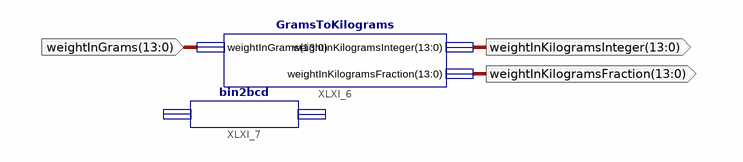
[diagram p0: schematic sheet 1]
// Xilinx ISE schematic esquematicoAAAAAAAAAAAAAAA.sch (artix7) as structural Verilog: 2 symbols, 3 ports
module esquematicoAAAAAAAAAAAAAAA (
  input  [13:0] weightInGrams,
  output [13:0] weightInKilogramsInteger,
  output [13:0] weightInKilogramsFraction
);

  GramsToKilograms XLXI_6 (
    .weightInGrams(weightInGrams), .weightInKilogramsInteger(weightInKilogramsInteger),
    .weightInKilogramsFraction(weightInKilogramsFraction));
  bin2bcd XLXI_7 ();  // open: bin, bcd
endmodule
